# Altium schematic sheet OmegaDock.SchDoc
size A4
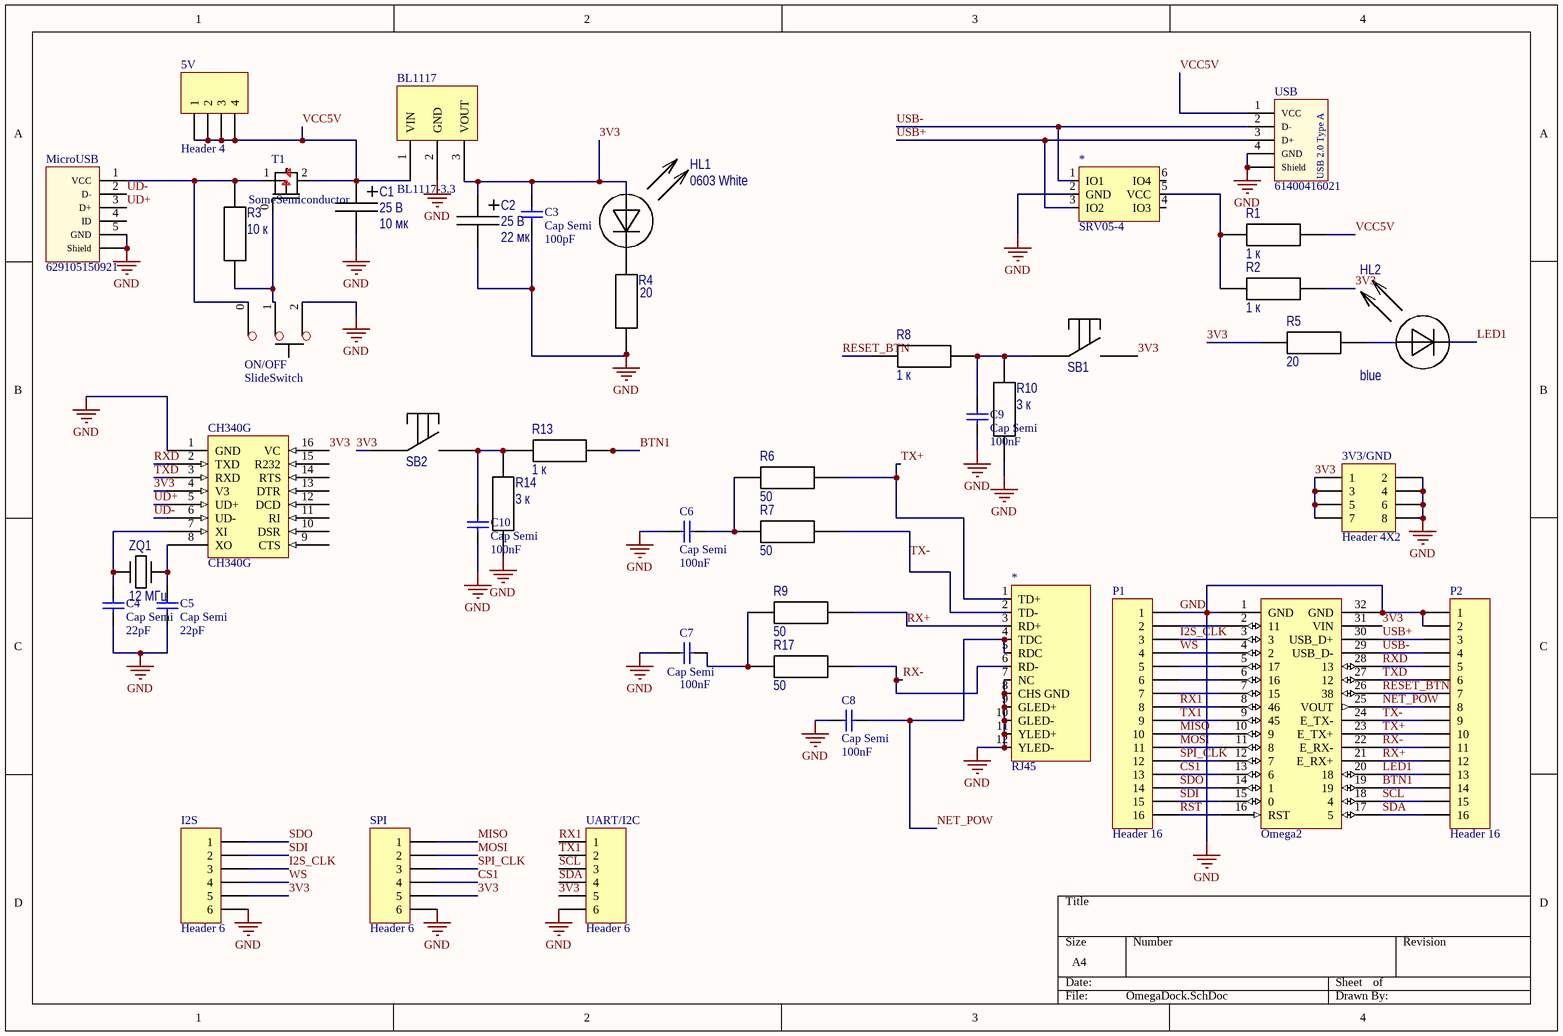
[diagram p0: OmegaDock.SchDoc]

## Parts
(Parts that share a designator on the sheet are numbered #1, #2 ... from top to bottom, then left to right.)
0mega2  Omega2  [Omega2PCB]
3V3/GND  Header 4X2  [HDR2X4]
5V  Header 4  [HDR1X4]
*#1  SRV05-4  [SOT23-6L]
*#2  RJ45  [R911105A]
BL1117  BL1117-3.3  [SOT223]
C1  value 10 мк  Rated voltage: 25 В  [C_Al_B]  (hidden comment: /Укажите код маркировки/)
C2  value 22 мк  Rated voltage: 25 В  [C_Al_B]  (hidden comment: /Укажите код маркировки/)
C3  Cap Semi  value 100pF  [C1206]
C4  Cap Semi  value 22pF  [C1206]
C5  Cap Semi  value 22pF  [C1206]
C6  Cap Semi  value 100nF  [C1206]
C7  Cap Semi  value 100nF  [C1206]
C8  Cap Semi  value 100nF  [C1206]
C9  Cap Semi  value 100nF  [C1206]
C10  Cap Semi  value 100nF  [C1206]
CH340G  CH340G  [SO16]
HL1  0603 White  [LED_0603_White_Manual_mount]
HL2  blue  [LED_0603_Blue_Manual_mount]
I2S  Header 6  [HDR1X6]
MicroUSB  629105150921  [629105150921]
ON/OFF  SlideSwitch  [SlideSwitch]
P1  Header 16  [HDR1X16]
P2  Header 16  [HDR1X16]
R1  value 1 к  [R_0402_Manual_mount]  (hidden comment: /Укажите код маркирвки/)
R2  value 1 к  [R_0402_Manual_mount]  (hidden comment: /Укажите код маркирвки/)
R3  value 10 к  [R_0402_Manual_mount]  (hidden comment: /Укажите код маркирвки/)
R4  value 20  [R_0402_Manual_mount]  (hidden comment: /Укажите код маркирвки/)
R5  value 20  [R_0402_Manual_mount]  (hidden comment: /Укажите код маркирвки/)
R6  value 50  [R_0402_Manual_mount]  (hidden comment: /Укажите код маркирвки/)
R7  value 50  [R_0402_Manual_mount]  (hidden comment: /Укажите код маркирвки/)
R8  value 1 к  [R_0402_Manual_mount]  (hidden comment: /Укажите код маркирвки/)
R9  value 50  [R_0402_Manual_mount]  (hidden comment: /Укажите код маркирвки/)
R10  value 3 к  [R_0402_Manual_mount]  (hidden comment: /Укажите код маркирвки/)
R13  value 1 к  [R_0402_Manual_mount]  (hidden comment: /Укажите код маркирвки/)
R14  value 3 к  [R_0402_Manual_mount]  (hidden comment: /Укажите код маркирвки/)
R17  value 50  [R_0402_Manual_mount]  (hidden comment: /Укажите код маркирвки/)
SB1  Tact_switch  [Tact_switch_6x6x7]  (value not drawn)
SB2  Tact_switch  [Tact_switch_6x6x7]  (value not drawn)
SPI  Header 6  [HDR1X6]
T1  SomeSemiconductor  [SOT23]
UART/I2C  Header 6  [HDR1X6]
USB  61400416021  [61400416021]
ZQ1  value 12 МГц  [HC-49SM]  (hidden comment: /Укажите код маркировки/)

## Nets
GND: 0mega2.1(GND) 0mega2.32(GND) 3V3/GND.2 3V3/GND.4 3V3/GND.6 3V3/GND.8 *#1.2(GND) *#2.7(NC) *#2.8(CHS_GND) *#2.9(GLED+) *#2.10(GLED-) *#2.11(YLED+) *#2.12(YLED-) BL1117.2(GND) C1.2 C2.2 C3.2 C4.2 C5.2 C6.1 C7.1 C8.1 C9.1 C10.1 CH340G.1(GND) I2S.6 MicroUSB.5(GND) MicroUSB.Shell(Shield) ON/OFF.2 P1.1 P2.1 P2.2 R4.2 R10.2 R14.2 SPI.6 UART/I2C.6 USB.4(GND) USB.Shell(Shield)
3V3: 0mega2.31(VIN) 3V3/GND.1 3V3/GND.3 3V3/GND.5 3V3/GND.7 BL1117.3(VOUT) C2.1 C3.1 CH340G.4(V3) CH340G.16(VC) HL1.A I2S.5 R2.2 R5.1 SB1.2 SB2.1 SPI.5 UART/I2C.5
BTN1: 0mega2.19 P2.14 R13.2
CS1: 0mega2.13(6) P1.13 SPI.4
I2S_CLK: 0mega2.3 I2S.3 P1.3
LED1: 0mega2.20(18) HL2.C P2.13
MISO: 0mega2.10(9) P1.10 SPI.1
MOSI: 0mega2.11(8) P1.11 SPI.2
NET_POW: 0mega2.25(VOUT) *#2.4(TDC) *#2.5(RDC) C8.2 P2.8
RESET_BTN: 0mega2.26(38) P2.7 R8.2
RST: 0mega2.16(RST) P1.16
RX1: 0mega2.8(46) P1.8 UART/I2C.1
RX+: 0mega2.21(E_RX+) *#2.3(RD+) P2.12 R9.1
RX-: 0mega2.22(E_RX-) *#2.6(RD-) P2.11 R17.1
RXD: 0mega2.28(13) CH340G.2(TXD) P2.5
SCL: 0mega2.18(4) P2.15 UART/I2C.3
SDA: 0mega2.17(5) P2.16 UART/I2C.4
SDI: 0mega2.15(0) I2S.2 P1.15
SDO: 0mega2.14(1) I2S.1 P1.14
SPI_CLK: 0mega2.12(7) P1.12 SPI.3
TX1: 0mega2.9(45) P1.9 UART/I2C.2
TX+: 0mega2.23(E_TX+) *#2.1(TD+) P2.10 R6.1
TX-: 0mega2.24(E_TX-) *#2.2(TD-) P2.9 R7.1
TXD: 0mega2.27(12) CH340G.3(RXD) P2.6
UD+: CH340G.5(UD+) MicroUSB.3(D+)
UD-: CH340G.6(UD-) MicroUSB.2(D-)
USB+: 0mega2.30(USB_D+) *#1.3(IO2) P2.3 USB.3(D+)
USB-: 0mega2.29(USB_D-) *#1.1(IO1) P2.4 USB.2(D-)
VCC5V: 5V.1 5V.2 5V.3 5V.4 BL1117.1(VIN) C1.1 R1.2 T1.2(DRAIL) USB.1(VCC)
WS: 0mega2.4(2) I2S.4 P1.4
Net0mega2_2: 0mega2.2(11) P1.2
Net0mega2_5: 0mega2.5(17) P1.5
Net0mega2_6: 0mega2.6(16) P1.6
Net0mega2_7: 0mega2.7(15) P1.7
Net*#1_5: *#1.5(VCC) R1.1 R2.1
NetC4_1: C4.1 CH340G.7(XI) ZQ1.1(XI)
NetC5_1: C5.1 CH340G.8(XO) ZQ1.2(XO)
NetC6_2: C6.2 R6.2 R7.2
NetC7_2: C7.2 R9.2 R17.2
NetC9_2: C9.2 R8.1 R10.1 SB1.1
NetC10_2: C10.2 R13.1 R14.1 SB2.2
NetHL1_C: HL1.C R4.1
NetHL2_A: HL2.A R5.2
NetMicroUSB_1: MicroUSB.1(VCC) ON/OFF.0 R3.1 T1.1(SOURCE)
NetON/OFF_1: ON/OFF.1 R3.2 T1.0(GATE)

Not connected (* = marked no-connect by the designer): *#1 4(IO3) 6(IO4); CH340G 9(CTS) 10(DSR) 11(RI) 12(DCD) 13(DTR) 14(RTS) 15(R232); MicroUSB 4(ID)

## Notes on the sheet
- (in symbol 61400416021) USB 2.0 Type A

## Library data of the parts
3V3/GND = Header 4X2: Header, 4-Pin, Dual row; LatestRevisionDate: 17-Jul-2002; LatestRevisionNote: Re-released for DXP Platform.; Publisher: Altium Limited
5V = Header 4: Header, 4-Pin; LatestRevisionDate: 17-Jul-2002; LatestRevisionNote: Re-released for DXP Platform.; Publisher: Altium Limited
C1 C2 = Capacitor_Electrolytic_B: SMD Electrolytic Capacitor; Manufacturer: /Укажите компанию-производителя/; Tolerance: /Укажите допуск в процентах/; Type: Конденсатор электролитический; ESR: /Укажите значение ЭПС/; Size: B; Temperature range: /Формат: -? ... ? °C/
C3-C10 = Cap Semi: Capacitor (Semiconductor SIM Model); Published: 8-Jun-2000; LatestRevisionDate: 29-May-2009; LatestRevisionNote: IPC-7351 Footprint Added.; PackageReference: C1206; Publisher: Altium Limited; PackageDescription: Chip Capacitor
HL1 HL2 = LED 0603: SMD LED; Manufacturer: /Укажите компанию-производителя/; Forward voltage: /Укажите прямое напряжение/; Power dissitipation: /Укажите максимальную рассеиваемую мощность/; Color: /Укажите цвет/; Type: Светодиод; Max. forward current: /Укажите допустимый прямой ток/; Max. reverse voltage: /Укажите максимальное обратное напряжение/; Size: 0603; Temperature range: /Формат: -? ... ? °C/
I2S SPI = Header 6: Header, 6-Pin; pin to pad: 1>6 2>5 3>4 4>3 5>2 6>1; LatestRevisionDate: 17-Jul-2002; LatestRevisionNote: Re-released for DXP Platform.; Publisher: Altium Limited
MicroUSB = 629105150921: Micro USB 2.0 Type AB Horizontal WR-COM; Interface Type: Type AB; Gender: Receptacle; ComponentLink1Description: Manufacturer; ComponentLink1URL: http://www.we-online.de; ComponentLink2Description: Datasheet; ComponentLink2URL: http://katalog.we-online.de/em/datasheet/629105150921.pdf; Part Number: 629105150921; Published Date: April 2017; Publisher: Wurth Elektronik; Sub-Family: Micro USB 2.0; Type: Horizontal; Construction: SMT
P1 P2 = Header 16: Header, 16-Pin; LatestRevisionDate: 17-Jul-2002; LatestRevisionNote: Re-released for DXP Platform.; Publisher: Altium Limited
R1-R10 R13 R14 R17 = Resistor: SMD Resistor; Manufacturer: /Укажите компанию-производителя/; Tolerance: /Укажите допуск в процентах/; Power dissitipation: /Укажите максимальную рассеиваемую мощность/; Temperature coefficient: /Формат: ±? ppm/°C/; Size: /Укажите дюймовый типоразмер/; Temperature range: /Формат: -? ... ? °C/; Type: Резистор постоянный
SB1 SB2 = Tact_switch: SMD pushbutton; Manufacturer: NONAME; Junction resistance: 100 мОм; Rated voltage: 12 В; Rated current: 50 мА; Life cycles: 100000; Type: Выключатель кнопочный с самовозвратом
UART/I2C = Header 6: Header, 6-Pin; LatestRevisionDate: 17-Jul-2002; LatestRevisionNote: Re-released for DXP Platform.; Publisher: Altium Limited
USB = 61400416021: USB 2.0 Type A Horizontal WR-COM; Interface Type: Type A; Sub-Family: USB 2.0; Gender: Receptacle; ComponentLink1Description: Manufacturer; ComponentLink1URL: http://www.we-online.de; ComponentLink2Description: Datasheet; ComponentLink2URL: http://katalog.we-online.de/em/datasheet/61400416021.pdf; Part Number: 61400416021; Published Date: April 2017; Publisher: Wurth Elektronik; Type: Horizontal; Construction: THT
ZQ1 = Quartz: QUARTZ CRYSTAL; Manufacturer: /Укажите компанию-производителя/; Load capacitance: /Укажите номинал нагрузочной емкости/; Frequency stability: /Формат: ±? ppm/; Type: Кварцевый резонатор; Temperature range: /Формат: -? ... ? °C/